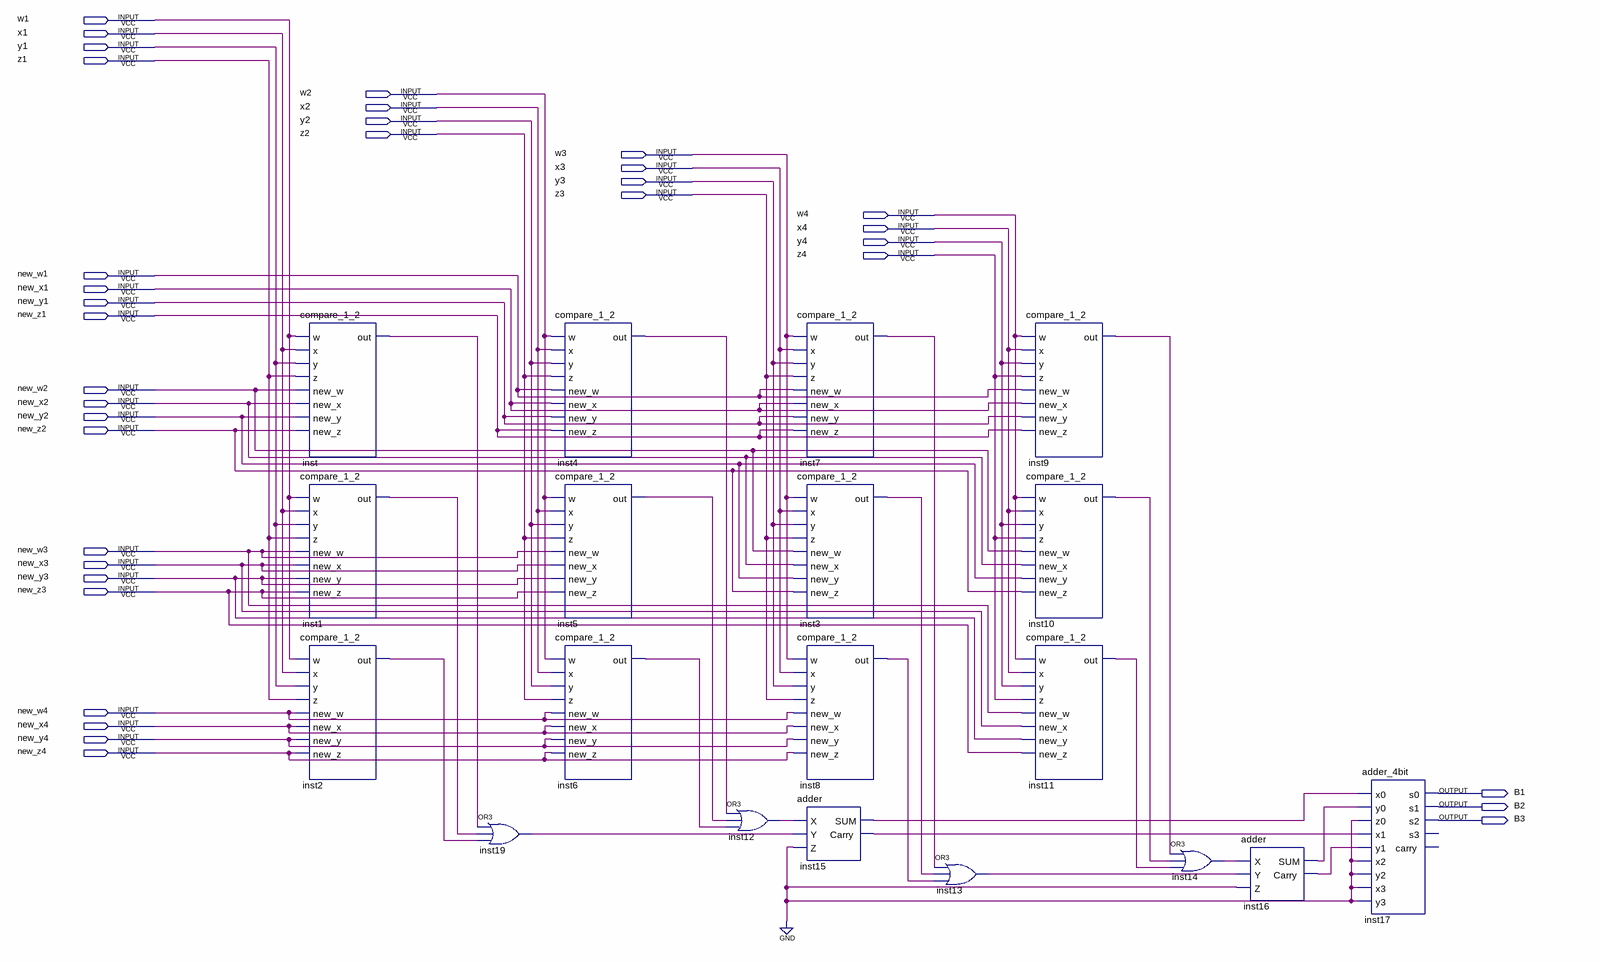
[diagram p0: schematic sheet]
// Quartus schematic XB.bdf as structural Verilog: 19 symbols, 35 pins
module XB (
  input  w1,
  input  x1,
  input  y1,
  input  z1,
  input  w2,
  input  x2,
  input  y2,
  input  z2,
  input  w3,
  input  x3,
  input  y3,
  input  z3,
  input  w4,
  input  x4,
  input  y4,
  input  z4,
  input  new_w1,
  input  new_x1,
  input  new_y1,
  input  new_z1,
  input  new_w2,
  input  new_x2,
  input  new_y2,
  input  new_z2,
  input  new_w3,
  input  new_x3,
  input  new_y3,
  input  new_z3,
  input  new_w4,
  input  new_x4,
  input  new_y4,
  input  new_z4,
  output B1,
  output B2,
  output B3
);

  wire inst1_out, inst2_out, inst3_out, inst4_out, inst5_out, inst6_out, inst7_out, inst8_out, inst9_out,
       inst10_out, inst11_out, inst12_out, inst13_out, inst14_out, inst15_carry, inst15_sum, inst16_carry,
       inst16_sum, inst19_out, inst_out;

  compare_1_2 inst (
    .w(w1), .x(x1), .y(y1), .z(z1), .new_w(new_w2), .new_x(new_x2), .new_y(new_y2), .new_z(new_z2),
    .out(inst_out));
  compare_1_2 inst1 (
    .w(w1), .x(x1), .y(y1), .z(z1), .new_w(new_w3), .new_x(new_x3), .new_y(new_y3), .new_z(new_z3),
    .out(inst1_out));
  compare_1_2 inst2 (
    .w(w1), .x(x1), .y(y1), .z(z1), .new_w(new_w4), .new_x(new_x4), .new_y(new_y4), .new_z(new_z4),
    .out(inst2_out));
  or inst19 (inst19_out, inst_out, inst1_out, inst2_out);
  compare_1_2 inst4 (
    .w(w2), .x(x2), .y(y2), .z(z2), .new_w(new_w1), .new_x(new_x1), .new_y(new_y1), .new_z(new_z1),
    .out(inst4_out));
  compare_1_2 inst5 (
    .w(w2), .x(x2), .y(y2), .z(z2), .new_w(new_w3), .new_x(new_x3), .new_y(new_y3), .new_z(new_z3),
    .out(inst5_out));
  compare_1_2 inst6 (
    .w(w2), .x(x2), .y(y2), .z(z2), .new_w(new_w4), .new_x(new_x4), .new_y(new_y4), .new_z(new_z4),
    .out(inst6_out));
  or inst12 (inst12_out, inst4_out, inst5_out, inst6_out);
  compare_1_2 inst7 (
    .w(w3), .x(x3), .y(y3), .z(z3), .new_w(new_w1), .new_x(new_x1), .new_y(new_y1), .new_z(new_z1),
    .out(inst7_out));
  compare_1_2 inst3 (
    .w(w3), .x(x3), .y(y3), .z(z3), .new_w(new_w2), .new_x(new_x2), .new_y(new_y2), .new_z(new_z2),
    .out(inst3_out));
  compare_1_2 inst8 (
    .w(w3), .x(x3), .y(y3), .z(z3), .new_w(new_w4), .new_x(new_x4), .new_y(new_y4), .new_z(new_z4),
    .out(inst8_out));
  adder inst15 (.X(inst12_out), .Y(inst19_out), .Z(1'b0), .SUM(inst15_sum), .Carry(inst15_carry));
  or inst13 (inst13_out, inst7_out, inst3_out, inst8_out);
  compare_1_2 inst9 (
    .w(w4), .x(x4), .y(y4), .z(z4), .new_w(new_w1), .new_x(new_x1), .new_y(new_y1), .new_z(new_z1),
    .out(inst9_out));
  compare_1_2 inst10 (
    .w(w4), .x(x4), .y(y4), .z(z4), .new_w(new_w2), .new_x(new_x2), .new_y(new_y2), .new_z(new_z2),
    .out(inst10_out));
  compare_1_2 inst11 (
    .w(w4), .x(x4), .y(y4), .z(z4), .new_w(new_w3), .new_x(new_x3), .new_y(new_y3), .new_z(new_z3),
    .out(inst11_out));
  or inst14 (inst14_out, inst9_out, inst10_out, inst11_out);
  adder inst16 (.X(inst14_out), .Y(inst13_out), .Z(1'b0), .SUM(inst16_sum), .Carry(inst16_carry));
  adder_4bit inst17 (
    .x0(inst15_sum), .y0(inst16_sum), .z0(1'b0), .x1(inst15_carry), .y1(inst16_carry), .x2(1'b0), .y2(1'b0),
    .x3(1'b0), .y3(1'b0), .s0(B1), .s1(B2), .s2(B3));  // open: s3, carry
endmodule
